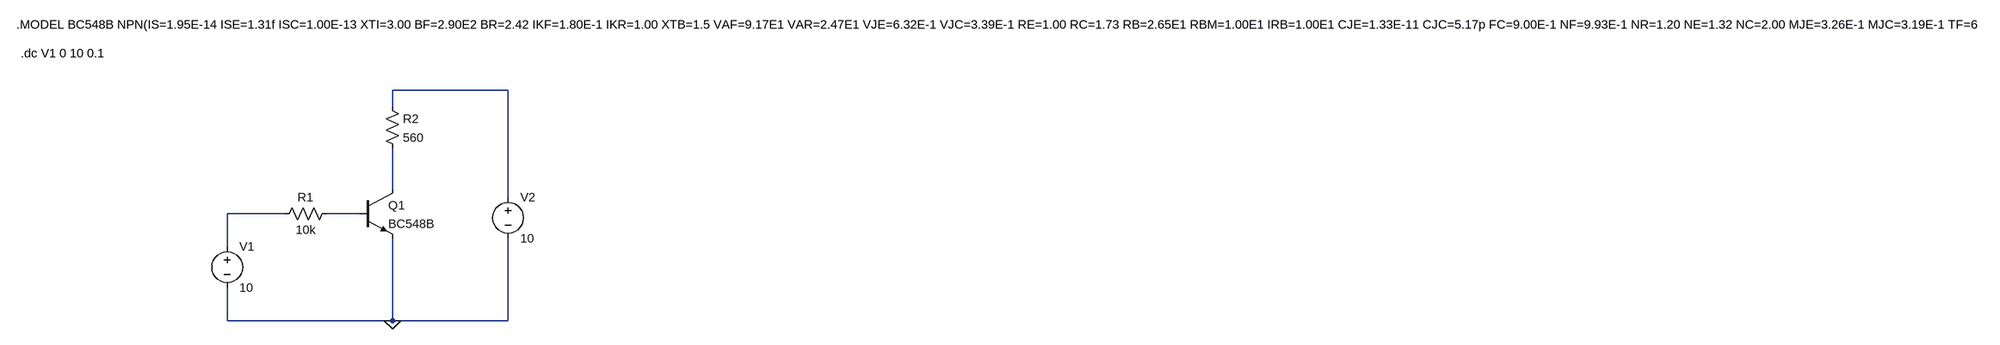
[diagram p0: schematic polarizacion1.asc]
polarizacion1.asc, the LTspice schematic file:
Version 4.1
SHEET 1 4812 680
WIRE 544 -176 320 -176
WIRE 320 -144 320 -176
WIRE 320 16 320 -64
WIRE 544 32 544 -176
WIRE 112 64 0 64
WIRE 256 64 192 64
WIRE 0 128 0 64
WIRE 0 272 0 208
WIRE 320 272 320 112
WIRE 320 272 0 272
WIRE 544 272 544 112
WIRE 544 272 320 272
FLAG 320 272 0
SYMBOL voltage 0 112 R0
SYMATTR InstName V1
SYMATTR Value 10
SYMBOL res 208 48 R90
WINDOW 0 0 56 VBottom 2
WINDOW 3 32 56 VTop 2
SYMATTR InstName R1
SYMATTR Value 10k
SYMBOL res 304 -160 R0
SYMATTR InstName R2
SYMATTR Value 560
SYMBOL voltage 544 16 R0
SYMATTR InstName V2
SYMATTR Value 10
SYMBOL npn 256 16 R0
SYMATTR InstName Q1
SYMATTR Value BC548B
TEXT -408 -304 Left 2 !.MODEL BC548B NPN(IS=1.95E-14 ISE=1.31f ISC=1.00E-13 XTI=3.00 BF=2.90E2 BR=2.42 IKF=1.80E-1 IKR=1.00 XTB=1.5 VAF=9.17E1 VAR=2.47E1 VJE=6.32E-1 VJC=3.39E-1 RE=1.00 RC=1.73 RB=2.65E1 RBM=1.00E1 IRB=1.00E1 CJE=1.33E-11 CJC=5.17p FC=9.00E-1 NF=9.93E-1 NR=1.20 NE=1.32 NC=2.00 MJE=3.26E-1 MJC=3.19E-1 TF=6.52E-10 TR=0 ITF=1.03 VTF=1.65 XTF=1.00E2 EG=1.11 VCEO=30 ICRATING=100m MFG=PHILIPS)
TEXT -400 -248 Left 2 !.dc V1 0 10 0.1

The netlist it stands for:
* polarizacion1.asc
V1 N003 0 10
R1 N004 N003 10k
R2 N001 N002 560
V2 N001 0 10
Q1 N002 N004 0 0 BC548B
.model NPN NPN
.model PNP PNP
.lib standard.bjt
.MODEL BC548B NPN(IS=1.95E-14 ISE=1.31f ISC=1.00E-13 XTI=3.00 BF=2.90E2 BR=2.42 IKF=1.80E-1 IKR=1.00 XTB=1.5 VAF=9.17E1 VAR=2.47E1 VJE=6.32E-1 VJC=3.39E-1 RE=1.00 RC=1.73 RB=2.65E1 RBM=1.00E1 IRB=1.00E1 CJE=1.33E-11 CJC=5.17p FC=9.00E-1 NF=9.93E-1 NR=1.20 NE=1.32 NC=2.00 MJE=3.26E-1 MJC=3.19E-1 TF=6.52E-10 TR=0 ITF=1.03 VTF=1.65 XTF=1.00E2 EG=1.11 VCEO=30 ICRATING=100m MFG=PHILIPS)
.dc V1 0 10 0.1
.backanno
.end